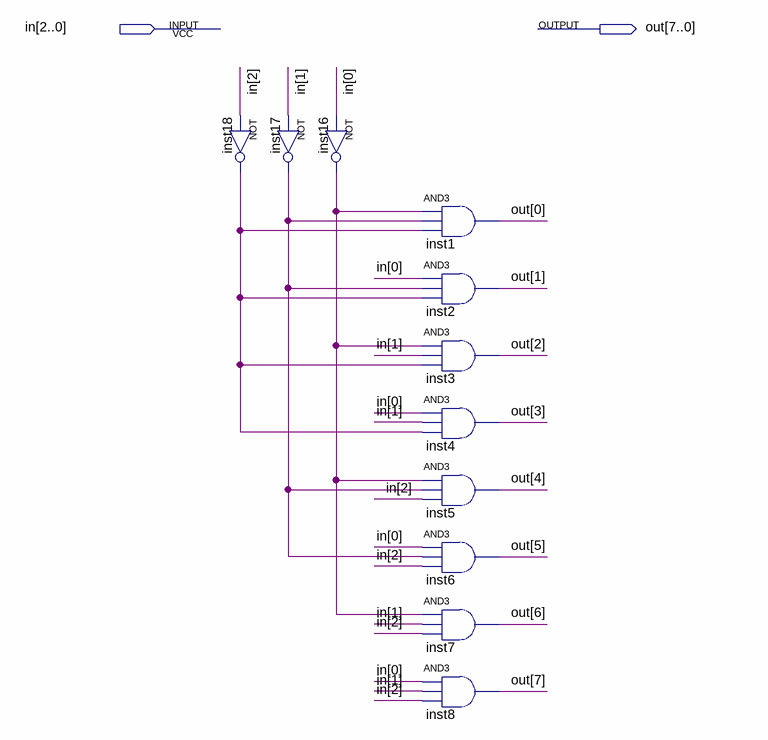
[diagram p0: schematic sheet]
// Quartus schematic Decoder_3x8.bdf as structural Verilog: 11 symbols, 2 pins
module Decoder_3x8 (
  input  [2:0] in,
  output [7:0] out
);

  wire inst16_out, inst17_out, inst18_out;

  not inst17 (inst17_out, in[1]);
  not inst18 (inst18_out, in[2]);
  not inst16 (inst16_out, in[0]);
  and inst1 (out[0], inst16_out, inst17_out, inst18_out);
  and inst2 (out[1], in[0], inst17_out, inst18_out);
  and inst3 (out[2], inst16_out, in[1], inst18_out);
  and inst4 (out[3], in[0], in[1], inst18_out);
  and inst5 (out[4], inst16_out, inst17_out, in[2]);
  and inst6 (out[5], in[0], inst17_out, in[2]);
  and inst7 (out[6], inst16_out, in[1], in[2]);
  and inst8 (out[7], in[0], in[1], in[2]);
endmodule
